# Altium schematic sheet ngv-main.SchDoc
size A2; PageSetup: Record=PageOptions|CenterHorizontal=True|CenterVertical=True|PrintScale=0.52|XCorrection=1.00|YCorrection=1.00|PrintKind=1|BorderSize=5000000|LeftOffset=0|BottomOffset=0|Orientation=2|PaperLength=1000|PaperWidth=1000|Scale=100|PaperSource=7|PrintQuality=600|MediaType=1|DitherType=10|PrintScaleMode=1|PaperKind=A4|PaperIndex=9
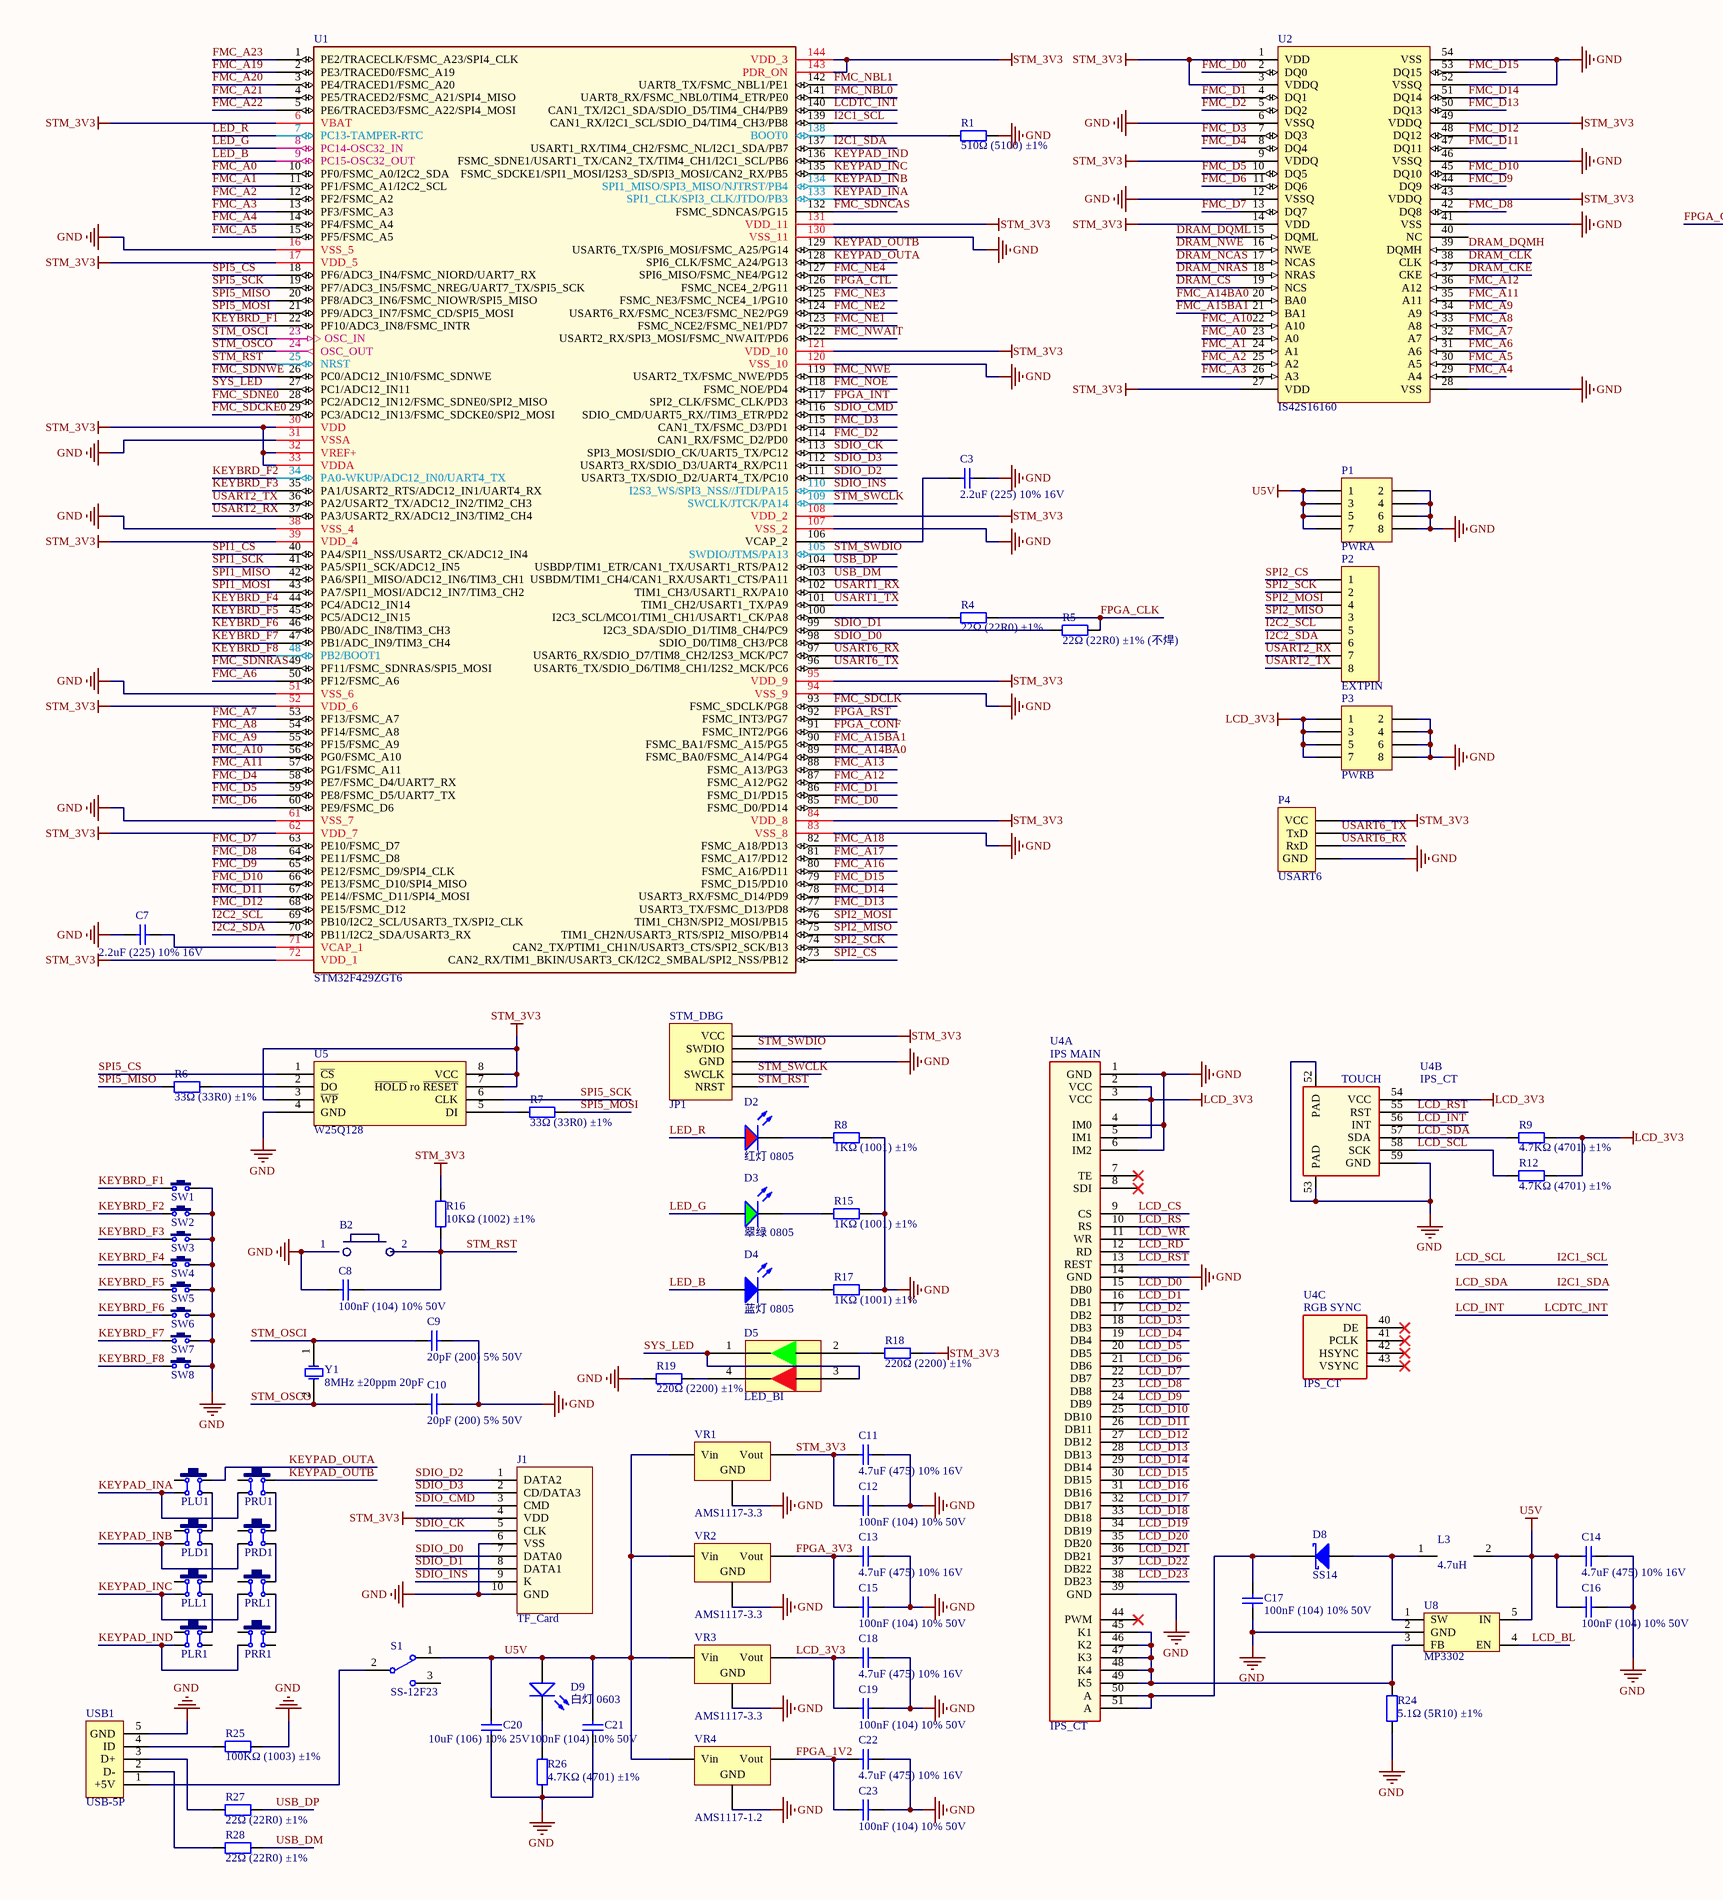
[diagram p0: ngv-main.SchDoc, left]
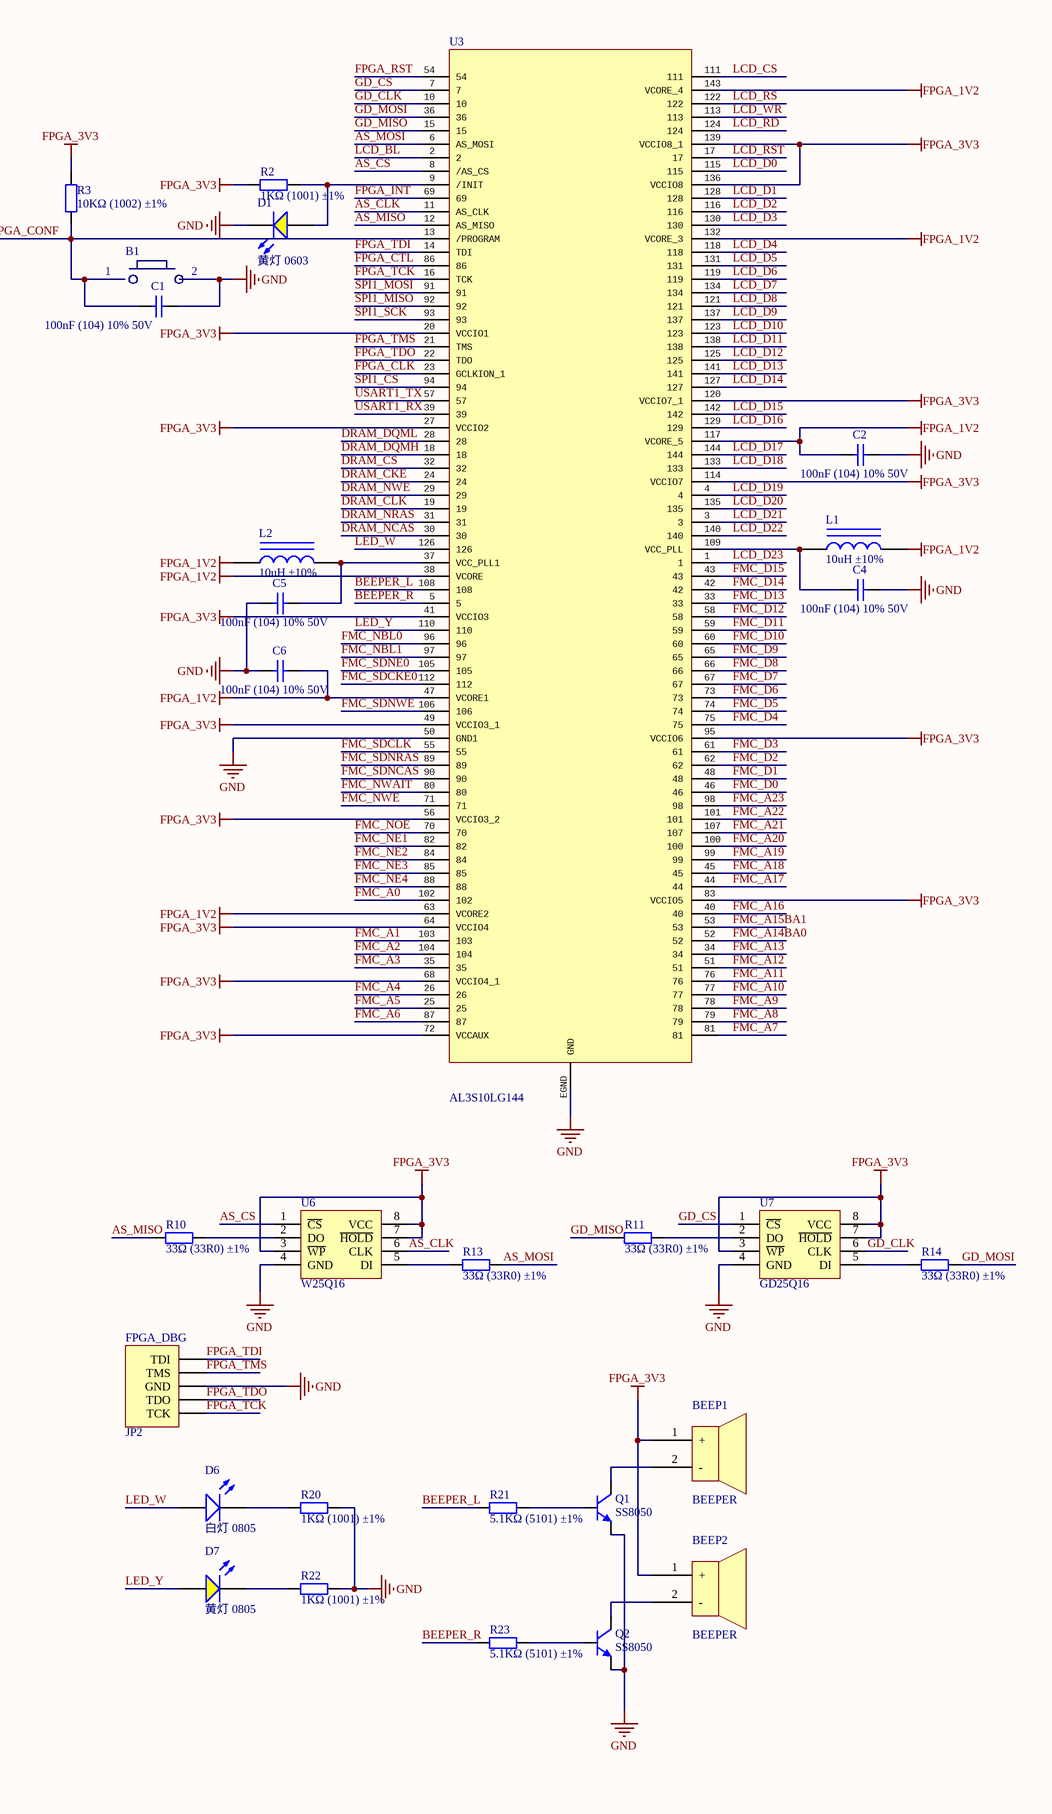
[diagram p1: ngv-main.SchDoc, right]

## Parts
B1  B1  [MetalButton]  (value not drawn)
B2  B1  [MetalButton]  (value not drawn)
BEEP1  BEEPER  [BEEPER]
BEEP2  BEEPER  [BEEPER]
C1  100nF (104) 10% 50V  [0603_C]
C2  100nF (104) 10% 50V  [0603_C]
C3  2.2uF (225) 10% 16V  [0603_C]
C4  100nF (104) 10% 50V  [0603_C]
C5  100nF (104) 10% 50V  [0603_C]
C6  100nF (104) 10% 50V  [0603_C]
C7  2.2uF (225) 10% 16V  [0603_C]
C8  100nF (104) 10% 50V  [0603_C]
C9  20pF (200) 5% 50V  [0603_C]
C10  20pF (200) 5% 50V  [0603_C]
C11  4.7uF (475) 10% 16V  [0603_C]
C12  100nF (104) 10% 50V  [0603_C]
C13  4.7uF (475) 10% 16V  [0603_C]
C14  4.7uF (475) 10% 16V  [0603_C]
C15  100nF (104) 10% 50V  [0603_C]
C16  100nF (104) 10% 50V  [0603_C]
C17  100nF (104) 10% 50V  [0603_C]
C18  4.7uF (475) 10% 16V  [0603_C]
C19  100nF (104) 10% 50V  [0603_C]
C20  10uF (106) 10% 25V  [0805_C]
C21  100nF (104) 10% 50V  [0603_C]
C22  4.7uF (475) 10% 16V  [0603_C]
C23  100nF (104) 10% 50V  [0603_C]
D1  黄灯 0603  [0603_LED_S1]
D2  红灯 0805  [0805_LED_S1]
D3  翠绿 0805  [0805_LED_S1]
D4  蓝灯 0805  [0805_LED_S1]
D5  LED_BI  [LED_BI]
D6  白灯 0805  [0805_LED_S1]
D7  黄灯 0805  [0805_LED_S1]
D8  SS14  [SOD123]
D9  白灯 0603  [0603_LED_S1]
J1  TF_Card  [Micro SD]
JP1  STM_DBG  [XH2.54-WS-5P]
JP2  FPGA_DBG  [XH2.54-WS-5P]
L1  10uH ±10%  [0603_L]
L2  10uH ±10%  [0603_L]
L3  4.7uH  [L453226]
P1  PWRA  [HDR2X4]
P2  EXTPIN  [HDR1X8]
P3  PWRB  [HDR2X4]
P4  USART6  [HDR1X4H]
PLD1  12x12x5  [TSW SMD-12*12*6]  (value not drawn)
PLL1  12x12x5  [TSW SMD-12*12*6]  (value not drawn)
PLR1  12x12x5  [TSW SMD-12*12*6]  (value not drawn)
PLU1  12x12x5  [TSW SMD-12*12*6]  (value not drawn)
PRD1  12x12x5  [TSW SMD-12*12*6]  (value not drawn)
PRL1  12x12x5  [TSW SMD-12*12*6]  (value not drawn)
PRR1  12x12x5  [TSW SMD-12*12*6]  (value not drawn)
PRU1  12x12x5  [TSW SMD-12*12*6]  (value not drawn)
Q1  SS8050  [SOT23-3M]
Q2  SS8050  [SOT23-3M]
R1  510Ω (5100) ±1%  [0603_R]
R2  1KΩ (1001) ±1%  [0603_R]
R3  10KΩ (1002) ±1%  [0603_R]
R4  22Ω (22R0) ±1%  [0805_R]
R5  22Ω (22R0) ±1% (不焊)  [0805_R]
R6  33Ω (33R0) ±1%  [0603_R]
R7  33Ω (33R0) ±1%  [0603_R]
R8  1KΩ (1001) ±1%  [0603_R]
R9  4.7KΩ (4701) ±1%  [0603_R]
R10  33Ω (33R0) ±1%  [0603_R]
R11  33Ω (33R0) ±1%  [0603_R]
R12  4.7KΩ (4701) ±1%  [0603_R]
R13  33Ω (33R0) ±1%  [0603_R]
R14  33Ω (33R0) ±1%  [0603_R]
R15  1KΩ (1001) ±1%  [0603_R]
R16  10KΩ (1002) ±1%  [0603_R]
R17  1KΩ (1001) ±1%  [0603_R]
R18  220Ω (2200) ±1%  [0402_R]
R19  220Ω (2200) ±1%  [0402_R]
R20  1KΩ (1001) ±1%  [0603_R]
R21  5.1KΩ (5101) ±1%  [0603_R]
R22  1KΩ (1001) ±1%  [0603_R]
R23  5.1KΩ (5101) ±1%  [0603_R]
R24  5.1Ω (5R10) ±1%  [0603_R]
R25  100KΩ (1003) ±1%  [0603_R]
R26  4.7KΩ (4701) ±1%  [0603_R]
R27  22Ω (22R0) ±1%  [0603_R]
R28  22Ω (22R0) ±1%  [0603_R]
S1  SS-12F23  [SS-12F23]
SW1  3x6x5  [TSW SMD-3*6*4.3]  (value not drawn)
SW2  3x6x5  [TSW SMD-3*6*4.3]  (value not drawn)
SW3  3x6x5  [TSW SMD-3*6*4.3]  (value not drawn)
SW4  3x6x5  [TSW SMD-3*6*4.3]  (value not drawn)
SW5  3x6x5  [TSW SMD-3*6*4.3]  (value not drawn)
SW6  3x6x5  [TSW SMD-3*6*4.3]  (value not drawn)
SW7  3x6x5  [TSW SMD-3*6*4.3]  (value not drawn)
SW8  3x6x5  [TSW SMD-3*6*4.3]  (value not drawn)
U1  STM32F429ZGT6  [LQFP-144_20x20x05P]
U2  IS42S16160  [TSOP54-II]
U3  AL3S10LG144  [AL_EQFP144]
U4  IPS_CT  [IPS_CT]  (parts A,B,C of 3)
U5  W25Q128  [SOIC-8_208mil]
U6  W25Q16  [SOP8W_N]
U7  GD25Q16  [SOP8W_N]
U8  MP3302  [SOT23-5]
USB1  USB-5P  [USB-MICRO_D]
VR1  AMS1117-3.3  [SOT-223]
VR2  AMS1117-3.3  [SOT-223]
VR3  AMS1117-3.3  [SOT-223]
VR4  AMS1117-1.2  [SOT-223]
Y1  8MHz ±20ppm 20pF  [SMD-5032_2P]

## Nets
FPGA_1V2: C2.1 C6.2 C22.2 C23.2 L1.2 L2.1 U3.38(VCORE) U3.47(VCORE1) U3.63(VCORE2) U3.117(VCORE_5) U3.132(VCORE_3) U3.143(VCORE_4) VR4.2(Vout)
FPGA_3V3: BEEP1.1(+) BEEP2.1(+) C13.2 C15.2 R2.1 R3.2 U3.20(VCCIO1) U3.27(VCCIO2) U3.41(VCCIO3) U3.49(VCCIO3_1) U3.56(VCCIO3_2) U3.64(VCCIO4) U3.68(VCCIO4_1) U3.72(VCCAUX) U3.83(VCCIO5) U3.95(VCCIO6) U3.114(VCCIO7) U3.120(VCCIO7_1) U3.136(VCCIO8) U3.139(VCCIO8_1) U6.3(~{WP}) U6.7(~{HOLD}) U6.8(VCC) U7.3(~{WP}) U7.7(~{HOLD}) U7.8(VCC) VR2.2(Vout)
GND: B1.2 B2.1 C1.2 C2.2 C3.2 C4.2 C5.1 C6.1 C7.1 C8.1 C9.2 C10.2 C11.1 C12.1 C13.1 C14.2 C15.1 C16.2 C17.1 C18.1 C19.1 C20.1 C21.1 C22.1 C23.1 D1.K J1.6(VSS) J1.10(GND) JP1.3(GND) JP2.3(GND) P1.2 P1.4 P1.6 P1.8 P3.2 P3.4 P3.6 P3.8 P4.1(GND) Q1.2(E) Q2.2(E) R1.2 R8.2 R15.2 R17.2 R19.1 R20.2 R22.2 R24.1 R25.2 R26.1 SW1.2 SW2.2 SW3.2 SW4.2 SW5.2 SW6.2 SW7.2 SW8.2 U1.16(VSS_5) U1.31(VSSA) U1.38(VSS_4) U1.51(VSS_6) U1.61(VSS_7) U1.83(VSS_8) U1.94(VSS_9) U1.107(VSS_2) U1.120(VSS_10) U1.130(VSS_11) U2.6(VSSQ) U2.12(VSSQ) U2.28(VSS) U2.41(VSS) U2.46(VSSQ) U2.52(VSSQ) U2.54(VSS) U3.50(GND1) U3.EGND(GND) U4.1(GND) U4.4(IM0) U4.6(IM2) U4.14(GND) U4.39(GND) U4.52(PAD) U4.53(PAD) U4.59(GND) U5.4(GND) U6.4(GND) U7.4(GND) U8.2(GND) USB1.5(GND) VR1.1(GND) VR2.1(GND) VR3.1(GND) VR4.1(GND)
LCD_3V3: C18.2 C19.2 P3.1 P3.3 P3.5 P3.7 R9.2 R12.2 U4.2(VCC) U4.3(VCC) U4.5(IM1) U4.54(VCC) VR3.2(Vout)
STM_3V3: C11.2 C12.2 J1.4(VDD) JP1.5(VCC) P4.4(VCC) R16.2 R18.2 U1.6(VBAT) U1.17(VDD_5) U1.30(VDD) U1.32(VREF+) U1.33(VDDA) U1.39(VDD_4) U1.52(VDD_6) U1.62(VDD_7) U1.72(VDD_1) U1.84(VDD_8) U1.95(VDD_9) U1.108(VDD_2) U1.121(VDD_10) U1.131(VDD_11) U1.143(PDR_ON) U1.144(VDD_3) U2.1(VDD) U2.3(VDDQ) U2.9(VDDQ) U2.14(VDD) U2.27(VDD) U2.43(VDDQ) U2.49(VDDQ) U5.3(~{WP}) U5.7(~{HOLD}_ro_~{RESET}) U5.8(VCC) VR1.2(Vout)
U5V: C14.1 C16.1 C20.2 C21.2 D9.A L3.2 P1.1 P1.3 P1.5 P1.7 S1.1 U8.5(IN) VR1.3(Vin) VR2.3(Vin) VR3.3(Vin) VR4.3(Vin)
AS_CLK: U3.11(AS_CLK) U6.6(CLK)
AS_CS: U3.8(/AS_CS) U6.1(~{CS})
AS_MISO: R10.1 U3.12(AS_MISO)
AS_MOSI: R13.2 U3.6(AS_MOSI)
BEEPER_L: R21.1 U3.108
BEEPER_R: R23.1 U3.5
DRAM_CKE: U2.37(CKE) U3.24
DRAM_CLK: U2.38(CLK) U3.19
DRAM_CS: U2.19(NCS) U3.32
DRAM_DQMH: U2.39(DQMH) U3.18
DRAM_DQML: U2.15(DQML) U3.28
DRAM_NCAS: U2.17(NCAS) U3.30
DRAM_NRAS: U2.18(NRAS) U3.31
DRAM_NWE: U2.16(NWE) U3.29
FMC_A0: U1.10(PF0/FSMC_A0/I2C2_SDA) U2.23(A0) U3.102
FMC_A1: U1.11(PF1/FSMC_A1/I2C2_SCL) U2.24(A1) U3.103
FMC_A2: U1.12(PF2/FSMC_A2) U2.25(A2) U3.104
FMC_A3: U1.13(PF3/FSMC_A3) U2.26(A3) U3.35
FMC_A4: U1.14(PF4/FSMC_A4) U2.29(A4) U3.26
FMC_A5: U1.15(PF5/FSMC_A5) U2.30(A5) U3.25
FMC_A6: U1.50(PF12/FSMC_A6) U2.31(A6) U3.87
FMC_A7: U1.53(PF13/FSMC_A7) U2.32(A7) U3.81
FMC_A8: U1.54(PF14/FSMC_A8) U2.33(A8) U3.79
FMC_A9: U1.55(PF15/FSMC_A9) U2.34(A9) U3.78
FMC_A10: U1.56(PG0/FSMC_A10) U2.22(A10) U3.77
FMC_A11: U1.57(PG1/FSMC_A11) U2.35(A11) U3.76
FMC_A12: U1.87(FSMC_A12/PG2) U2.36(A12) U3.51
FMC_A13: U1.88(FSMC_A13/PG3) U3.34
FMC_A14BA0: U1.89(FSMC_BA0/FSMC_A14/PG4) U2.20(BA0) U3.52
FMC_A15BA1: U1.90(FSMC_BA1/FSMC_A15/PG5) U2.21(BA1) U3.53
FMC_A16: U1.80(FSMC_A16/PD11) U3.40
FMC_A17: U1.81(FSMC_A17/PD12) U3.44
FMC_A18: U1.82(FSMC_A18/PD13) U3.45
FMC_A19: U1.2(PE3/TRACED0/FSMC_A19) U3.99
FMC_A20: U1.3(PE4/TRACED1/FSMC_A20) U3.100
FMC_A21: U1.4(PE5/TRACED2/FSMC_A21/SPI4_MISO) U3.107
FMC_A22: U1.5(PE6/TRACED3/FSMC_A22/SPI4_MOSI) U3.101
FMC_A23: U1.1(PE2/TRACECLK/FSMC_A23/SPI4_CLK) U3.98
FMC_D0: U1.85(FSMC_D0/PD14) U2.2(DQ0) U3.46
FMC_D1: U1.86(FSMC_D1/PD15) U2.4(DQ1) U3.48
FMC_D2: U1.114(CAN1_RX/FSMC_D2/PD0) U2.5(DQ2) U3.62
FMC_D3: U1.115(CAN1_TX/FSMC_D3/PD1) U2.7(DQ3) U3.61
FMC_D4: U1.58(PE7/FSMC_D4/UART7_RX) U2.8(DQ4) U3.75
FMC_D5: U1.59(PE8/FSMC_D5/UART7_TX) U2.10(DQ5) U3.74
FMC_D6: U1.60(PE9/FSMC_D6) U2.11(DQ6) U3.73
FMC_D7: U1.63(PE10/FSMC_D7) U2.13(DQ7) U3.67
FMC_D8: U1.64(PE11/FSMC_D8) U2.42(DQ8) U3.66
FMC_D9: U1.65(PE12/FSMC_D9/SPI4_CLK) U2.44(DQ9) U3.65
FMC_D10: U1.66(PE13/FSMC_D10/SPI4_MISO) U2.45(DQ10) U3.60
FMC_D11: U1.67(PE14//FSMC_D11/SPI4_MOSI) U2.47(DQ11) U3.59
FMC_D12: U1.68(PE15/FSMC_D12) U2.48(DQ12) U3.58
FMC_D13: U1.77(USART3_TX/FSMC_D13/PD8) U2.50(DQ13) U3.33
FMC_D14: U1.78(USART3_RX/FSMC_D14/PD9) U2.51(DQ14) U3.42
FMC_D15: U1.79(FSMC_D15/PD10) U2.53(DQ15) U3.43
FMC_NBL0: U1.141(UART8_RX/FSMC_NBL0/TIM4_ETR/PE0) U3.96
FMC_NBL1: U1.142(UART8_TX/FSMC_NBL1/PE1) U3.97
FMC_NE1: U1.123(FSMC_NCE2/FSMC_NE1/PD7) U3.82
FMC_NE2: U1.124(USART6_RX/FSMC_NCE3/FSMC_NE2/PG9) U3.84
FMC_NE3: U1.125(FSMC_NE3/FSMC_NCE4_1/PG10) U3.85
FMC_NE4: U1.127(SPI6_MISO/FSMC_NE4/PG12) U3.88
FMC_NOE: U1.118(FSMC_NOE/PD4) U3.70
FMC_NWAIT: U1.122(USART2_RX/SPI3_MOSI/FSMC_NWAIT/PD6) U3.80
FMC_NWE: U1.119(USART2_TX/FSMC_NWE/PD5) U3.71
FMC_SDCKE0: U1.29(PC3/ADC12_IN13/FSMC_SDCKE0/SPI2_MOSI) U3.112
FMC_SDCLK: U1.93(FSMC_SDCLK/PG8) U3.55
FMC_SDNCAS: U1.132(FSMC_SDNCAS/PG15) U3.90
FMC_SDNE0: U1.28(PC2/ADC12_IN12/FSMC_SDNE0/SPI2_MISO) U3.105
FMC_SDNRAS: U1.49(PF11/FSMC_SDNRAS/SPI5_MOSI) U3.89
FMC_SDNWE: U1.26(PC0/ADC12_IN10/FSMC_SDNWE) U3.106
FPGA_CLK: R4.2 R5.2 U3.23(GCLKION_1)
FPGA_CONF: B1.1 C1.1 R3.1 U1.91(FSMC_INT2/PG6) U3.13(/PROGRAM)
FPGA_CTL: U1.126(FSMC_NCE4_2/PG11) U3.86
FPGA_INT: U1.117(SPI2_CLK/FSMC_CLK/PD3) U3.69
FPGA_RST: U1.92(FSMC_INT3/PG7) U3.54
FPGA_TCK: JP2.1(TCK) U3.16(TCK)
FPGA_TDI: JP2.5(TDI) U3.14(TDI)
FPGA_TDO: JP2.2(TDO) U3.22(TDO)
FPGA_TMS: JP2.4(TMS) U3.21(TMS)
GD_CLK: U3.10 U7.6(CLK)
GD_CS: U3.7 U7.1(~{CS})
GD_MISO: R11.1 U3.15
GD_MOSI: R14.2 U3.36
I2C1_SCL: R12.1 U1.139(CAN1_RX/I2C1_SCL/SDIO_D4/TIM4_CH3/PB8) U4.58(SCK)  [also labelled LCD_SCL]
I2C1_SDA: R9.1 U1.137(USART1_RX/TIM4_CH2/FSMC_NL/I2C1_SDA/PB7) U4.57(SDA)  [also labelled LCD_SDA]
I2C2_SCL: P2.5 U1.69(PB10/I2C2_SCL/USART3_TX/SPI2_CLK)
I2C2_SDA: P2.6 U1.70(PB11/I2C2_SDA/USART3_RX)
KEYBRD_F1: SW1.1 U1.22(PF10/ADC3_IN8/FSMC_INTR)
KEYBRD_F2: SW2.1 U1.34(PA0-WKUP/ADC12_IN0/UART4_TX)
KEYBRD_F3: SW3.1 U1.35(PA1/USART2_RTS/ADC12_IN1/UART4_RX)
KEYBRD_F4: SW4.1 U1.44(PC4/ADC12_IN14)
KEYBRD_F5: SW5.1 U1.45(PC5/ADC12_IN15)
KEYBRD_F6: SW6.1 U1.46(PB0/ADC_IN8/TIM3_CH3)
KEYBRD_F7: SW7.1 U1.47(PB1/ADC_IN9/TIM3_CH4)
KEYBRD_F8: SW8.1 U1.48(PB2/BOOT1)
KEYPAD_INA: PLU1.4 PRU1.4 U1.133(SPI1_CLK/SPI3_CLK/JTDO/PB3)
KEYPAD_INB: PLD1.4 PRD1.4 U1.134(SPI1_MISO/SPI3_MISO/NJTRST/PB4)
KEYPAD_INC: PLL1.4 PRL1.4 U1.135(FSMC_SDCKE1/SPI1_MOSI/I2S3_SD/SPI3_MOSI/CAN2_RX/PB5)
KEYPAD_IND: PLR1.4 PRR1.4 U1.136(FSMC_SDNE1/USART1_TX/CAN2_TX/TIM4_CH1/I2C1_SCL/PB6)
KEYPAD_OUTA: PLU1.2 U1.128(SPI6_CLK/FSMC_A24/PG13)
KEYPAD_OUTB: PRU1.2 U1.129(USART6_TX/SPI6_MOSI/FSMC_A25/PG14)
LCD_BL: U3.2 U8.4(EN)
LCD_CS: U3.111 U4.9(CS)
LCD_D0: U3.115 U4.15(DB0)
LCD_D1: U3.128 U4.16(DB1)
LCD_D2: U3.116 U4.17(DB2)
LCD_D3: U3.130 U4.18(DB3)
LCD_D4: U3.118 U4.19(DB4)
LCD_D5: U3.131 U4.20(DB5)
LCD_D6: U3.119 U4.21(DB6)
LCD_D7: U3.134 U4.22(DB7)
LCD_D8: U3.121 U4.23(DB8)
LCD_D9: U3.137 U4.24(DB9)
LCD_D10: U3.123 U4.25(DB10)
LCD_D11: U3.138 U4.26(DB11)
LCD_D12: U3.125 U4.27(DB12)
LCD_D13: U3.141 U4.28(DB13)
LCD_D14: U3.127 U4.29(DB14)
LCD_D15: U3.142 U4.30(DB15)
LCD_D16: U3.129 U4.31(DB16)
LCD_D17: U3.144 U4.32(DB17)
LCD_D18: U3.133 U4.33(DB18)
LCD_D19: U3.4 U4.34(DB19)
LCD_D20: U3.135 U4.35(DB20)
LCD_D21: U3.3 U4.36(DB21)
LCD_D22: U3.140 U4.37(DB22)
LCD_D23: U3.1 U4.38(DB23)
LCD_INT: U1.140(CAN1_TX/I2C1_SDA/SDIO_D5/TIM4_CH4/PB9) U4.56(INT)  [also labelled LCDTC_INT]
LCD_RD: U3.124 U4.12(RD)
LCD_RS: U3.122 U4.10(RS)
LCD_RST: U3.17 U4.13(REST) U4.55(RST)
LCD_WR: U3.113 U4.11(WR)
LED_B: D4.A U1.9(PC15-OSC32_OUT)
LED_G: D3.A U1.8(PC14-OSC32_IN)
LED_R: D2.A U1.7(PC13-TAMPER-RTC)
LED_W: D6.A U3.126
LED_Y: D7.A U3.110
SDIO_CK: J1.5(CLK) U1.113(SPI3_MOSI/SDIO_CK/UART5_TX/PC12)
SDIO_CMD: J1.3(CMD) U1.116(SDIO_CMD/UART5_RX//TIM3_ETR/PD2)
SDIO_D0: J1.7(DATA0) U1.98(SDIO_D0/TIM8_CH3/PC8)
SDIO_D1: J1.8(DATA1) R5.1 U1.99(I2C3_SDA/SDIO_D1/TIM8_CH4/PC9)
SDIO_D2: J1.1(DATA2) U1.111(USART3_TX/SDIO_D2/UART4_TX/PC10)
SDIO_D3: J1.2(CD/DATA3) U1.112(USART3_RX/SDIO_D3/UART4_RX/PC11)
SDIO_INS: J1.9(K) U1.110(I2S3_WS/SPI3_NSS//JTDI/PA15)
SPI1_CS: U1.40(PA4/SPI1_NSS/USART2_CK/ADC12_IN4) U3.94
SPI1_MISO: U1.42(PA6/SPI1_MISO/ADC12_IN6/TIM3_CH1) U3.92
SPI1_MOSI: U1.43(PA7/SPI1_MOSI/ADC12_IN7/TIM3_CH2) U3.91
SPI1_SCK: U1.41(PA5/SPI1_SCK/ADC12_IN5) U3.93
SPI2_CS: P2.1 U1.73(CAN2_RX/TIM1_BKIN/USART3_CK/I2C2_SMBAL/SPI2_NSS/PB12)
SPI2_MISO: P2.3 U1.75(TIM1_CH2N/USART3_RTS/SPI2_MISO/PB14)
SPI2_MOSI: P2.4 U1.76(TIM1_CH3N/SPI2_MOSI/PB15)
SPI2_SCK: P2.2 U1.74(CAN2_TX/PTIM1_CH1N/USART3_CTS/SPI2_SCK/B13)
SPI5_CS: U1.18(PF6/ADC3_IN4/FSMC_NIORD/UART7_RX) U5.1(~{CS})
SPI5_MISO: R6.1 U1.20(PF8/ADC3_IN6/FSMC_NIOWR/SPI5_MISO)
SPI5_MOSI: R7.2 U1.21(PF9/ADC3_IN7/FSMC_CD/SPI5_MOSI)
SPI5_SCK: U1.19(PF7/ADC3_IN5/FSMC_NREG/UART7_TX/SPI5_SCK) U5.6(CLK)
STM_OSCI: C9.1 U1.23(OSC_IN) Y1.1(OSC1)
STM_OSCO: C10.1 U1.24(OSC_OUT) Y1.2(OSC2)
STM_RST: B2.2 C8.2 JP1.1(NRST) R16.1 U1.25(NRST)
STM_SWCLK: JP1.2(SWCLK) U1.109(SWCLK/JTCK/PA14)
STM_SWDIO: JP1.4(SWDIO) U1.105(SWDIO/JTMS/PA13)
SYS_LED: D5.1 D5.3 U1.27(PC1/ADC12_IN11)
USART1_RX: U1.102(TIM1_CH3/USART1_RX/PA10) U3.39
USART1_TX: U1.101(TIM1_CH2/USART1_TX/PA9) U3.57
USART2_RX: P2.7 U1.37(PA3/USART2_RX/ADC12_IN3/TIM2_CH4)
USART2_TX: P2.8 U1.36(PA2/USART2_TX/ADC12_IN2/TIM2_CH3)
USART6_RX: P4.2(RxD) U1.97(USART6_RX/SDIO_D7/TIM8_CH2/I2S3_MCK/PC7)
USART6_TX: P4.3(TxD) U1.96(USART6_TX/SDIO_D6/TIM8_CH1/I2S2_MCK/PC6)
USB_DM: R28.2 U1.103(USBDM/TIM1_CH4/CAN1_RX/USART1_CTS/PA11)
USB_DP: R27.2 U1.104(USBDP/TIM1_ETR/CAN1_TX/USART1_RTS/PA12)
NetBEEP1_2: BEEP1.2(-) Q1.3(C)
NetBEEP2_2: BEEP2.2(-) Q2.3(C)
NetC3_1: C3.1 U1.106(VCAP_2)
NetC4_1: C4.1 L1.1 U3.109(VCC_PLL)
NetC5_2: C5.2 L2.2 U3.37(VCC_PLL1)
NetC7_2: C7.2 U1.71(VCAP_1)
NetC17_2: C17.2 D8.2(K) U4.50(A) U4.51(A)
NetD1_A: D1.A R2.2 U3.9(/INIT)
NetD2_K: D2.K R8.1
NetD3_K: D3.K R15.1
NetD4_K: D4.K R17.1
NetD5_2: D5.2 R18.1
NetD5_4: D5.4 R19.2
NetD6_K: D6.K R20.1
NetD7_K: D7.K R22.1
NetD8_1: D8.1(A) L3.1 U8.1(SW)
NetD9_K: D9.K R26.2
NetPLD1_2: PLD1.2 PLU1.3
NetPLD1_3: PLD1.3 PLL1.2
NetPLL1_3: PLL1.3 PLR1.2
NetPRD1_2: PRD1.2 PRU1.3
NetPRD1_3: PRD1.3 PRL1.2
NetPRL1_3: PRL1.3 PRR1.2
NetQ1_1: Q1.1(B) R21.2
NetQ2_1: Q2.1(B) R23.2
NetR1_1: R1.1 U1.138(BOOT0)
NetR4_1: R4.1 U1.100(I2C3_SCL/MCO1/TIM1_CH1/USART1_CK/PA8)
NetR6_2: R6.2 U5.2(DO)
NetR7_1: R7.1 U5.5(DI)
NetR10_2: R10.2 U6.2(DO)
NetR11_2: R11.2 U7.2(DO)
NetR13_1: R13.1 U6.5(DI)
NetR14_1: R14.1 U7.5(DI)
NetR24_2: R24.2 U4.45(K1) U4.46(K2) U4.47(K3) U4.48(K4) U4.49(K5) U8.3(FB)
NetR25_1: R25.1 USB1.4(ID)
NetR27_1: R27.1 USB1.3(D+)
NetR28_1: R28.1 USB1.2(D-)
NetS1_2: S1.2 USB1.1(+5V)

Not connected (* = marked no-connect by the designer): PLD1 1; PLL1 1; PLR1 1 3; PLU1 1; PRD1 1; PRL1 1; PRR1 1 3; PRU1 1; S1 3; U2 40(NC); U4 7(TE)* 8(SDI)* 40(DE)* 41(PCLK)* 42(HSYNC)* 43(VSYNC)* 44(PWM)*

## Notes on the sheet
- (in symbol IPS_CT, part A) IPS MAIN
- (in symbol IPS_CT, part B) TOUCH
- (in symbol IPS_CT, part C) RGB SYNC

## Library data of the parts
B1 B2 = MetalButton
C1 C2 C4-C6 C8 C12 C15-C17 C19 C21 C23 = 0603 100nF (104) 10% 50V: 贴片电容; ComponentLink1Description: 供应商链接; ComponentLink1URL: http://www.szlcsc.com/product/details_15331.html; Package: 0603; Supplier: LC; SuppliersPartNumber: C14663
C3 C7 = 0603 2.2uF (225) 10% 16V: 贴片电容; ComponentLink1Description: 供应商链接; ComponentLink1URL: http://www.szlcsc.com/product/details_24366.html; Package: 0603; Supplier: LC; SuppliersPartNumber: C23630
C9 C10 = 0603 20pF (200) 5% 50V: 贴片电容; ComponentLink1Description: 供应商链接; ComponentLink1URL: http://www.szlcsc.com/product/details_2000.html; Package: 0603; Supplier: LC; SuppliersPartNumber: C1648
C11 C13 C14 C18 C22 = 0603 4.7uF (475) 10% 16V: 贴片电容; ComponentLink1Description: 供应商链接; ComponentLink1URL: http://www.szlcsc.com/product/details_20375.html; Package: 0603; Supplier: LC; SuppliersPartNumber: C19666
C20 = 0805 10uF (106) 10% 25V: 贴片电容; ComponentLink1Description: 供应商链接; ComponentLink1URL: http://www.szlcsc.com/product/details_16532.html; Package: 0805; Supplier: LC; SuppliersPartNumber: C15850
D1 = 0603 黄灯: 发光二极管; ComponentLink1Description: 供应商链接; ComponentLink1URL: http://www.szlcsc.com/product/details_73147.html; Package: 0603; Supplier: LC; SuppliersPartNumber: C72038
D2 = 0805 红灯: 发光二极管; ComponentLink1Description: 供应商链接; ComponentLink1URL: http://www.szlcsc.com/product/details_2668.html; Package: 0805; Supplier: LC; SuppliersPartNumber: C2295
D3 = 0805 翠绿: 发光二极管; ComponentLink1Description: 供应商链接; ComponentLink1URL: http://www.szlcsc.com/product/details_2670.html; Package: 0805; Supplier: LC; SuppliersPartNumber: C2297
D4 = 0805 蓝灯: 发光二极管; ComponentLink1Description: 供应商链接; ComponentLink1URL: http://www.szlcsc.com/product/details_2666.html; Package: 0805; Supplier: LC; SuppliersPartNumber: C2293
D6 = 0805 白灯: 发光二极管; ComponentLink1Description: 供应商链接; ComponentLink1URL: http://www.szlcsc.com/product/details_35468.html; Package: 0805; Supplier: LC; SuppliersPartNumber: C34499
D7 = 0805 黄灯: 发光二极管; ComponentLink1Description: 供应商链接; ComponentLink1URL: http://www.szlcsc.com/product/details_2669.html; Package: 0805; Supplier: LC; SuppliersPartNumber: C2296
D9 = 0603 白灯: 发光二极管; ComponentLink1Description: 供应商链接; ComponentLink1URL: http://www.szlcsc.com/product/details_2663.html; Package: 0603; Supplier: LC; SuppliersPartNumber: C2290
J1 = TF_Card: TF卡座; 版权归属: 源创客; BOM名称: TF卡座; 学习资源: www.ooocke.com
JP1 = STM_HDR: STM32; BOM名称: 5P接插件; 版权归属: 源创客; 学习资源: www.ooocke.com
JP2 = FPGA_HDR: FPGA; BOM名称: 5P接插件; 版权归属: 源创客; 学习资源: www.ooocke.com
L1 L2 = 0603 10uH 10%: 贴片电感; ComponentLink1Description: 供应商链接; ComponentLink1URL: http://www.szlcsc.com/product/details_1387.html; Package: 0603; Supplier: LC; SuppliersPartNumber: C1035
P1 P3 = Header 4X2: Header, 4-Pin, Dual row; LatestRevisionDate: 17-Jul-2002; LatestRevisionNote: Re-released for DXP Platform.; Publisher: Altium Limited
P2 = Header 8: Header, 8-Pin; LatestRevisionDate: 17-Jul-2002; LatestRevisionNote: Re-released for DXP Platform.; Publisher: Altium Limited
P4 = Header 4H: Header, 4-Pin, Right Angle; LatestRevisionDate: 17-Jul-2002; LatestRevisionNote: Re-released for DXP Platform.; Publisher: Altium Limited
PLD1 PLL1 PLR1 PLU1 PRD1 PRL1 PRR1 PRU1 = TSW SMD-12x12: 贴片12x12轻触开关; 版权归属: 源创客; BOM名称: 贴片12x12轻触开关; 学习资源: www.ooocke.com
Q1 Q2 = 8050-SMD: 高频放大-NPN型; 版权归属: 源创客; 属性: 40V 1.5A 1W 100MHZ; BOM名称: 高频放大-NPN型; 学习资源: www.ooocke.com
R1 = 0603 510Ω (5100) 1%: 贴片电阻; ComponentLink1Description: 供应商链接; ComponentLink1URL: http://www.szlcsc.com/product/details_23920.html; Package: 0603; Supplier: LC; SuppliersPartNumber: C23193
R2 R8 R15 R17 R20 R22 = 0603 1KΩ (1001) 1%: 贴片电阻; ComponentLink1Description: 供应商链接; ComponentLink1URL: http://www.szlcsc.com/product/details_21904.html; Package: 0603; Supplier: LC; SuppliersPartNumber: C21190
R3 R16 = 0603 10KΩ (1002) 1%: 贴片电阻; ComponentLink1Description: 供应商链接; ComponentLink1URL: http://www.szlcsc.com/product/details_26547.html; Package: 0603; Supplier: LC; SuppliersPartNumber: C25804
R4 R5 = 0805 22Ω (22R0) 1%: 贴片电阻; ComponentLink1Description: 供应商链接; ComponentLink1URL: http://www.szlcsc.com/product/details_18249.html; Package: 0805; Supplier: LC; SuppliersPartNumber: C17561
R6 R7 R10 R11 R13 R14 = 0603 33Ω (33R0) 1%: 贴片电阻; ComponentLink1Description: 供应商链接; ComponentLink1URL: http://www.szlcsc.com/product/details_23867.html; Package: 0603; Supplier: LC; SuppliersPartNumber: C23140
R9 R12 R26 = 0603 4.7KΩ (4701) 1%: 贴片电阻; ComponentLink1Description: 供应商链接; ComponentLink1URL: http://www.szlcsc.com/product/details_23889.html; Package: 0603; Supplier: LC; SuppliersPartNumber: C23162
R18 R19 = 0402 220Ω (2200) 1%: 贴片电阻; ComponentLink1Description: 供应商链接; ComponentLink1URL: http://www.szlcsc.com/product/details_25834.html; Package: 0402; Supplier: LC; SuppliersPartNumber: C25091
R21 R23 = 0603 5.1KΩ (5101) 1%: 贴片电阻; ComponentLink1Description: 供应商链接; ComponentLink1URL: http://www.szlcsc.com/product/details_23913.html; Package: 0603; Supplier: LC; SuppliersPartNumber: C23186
R24 = 0603 5.1Ω (5R10) 1%: 贴片电阻; ComponentLink1Description: 供应商链接; ComponentLink1URL: http://www.szlcsc.com/product/details_25940.html; Package: 0603; Supplier: LC; SuppliersPartNumber: C25197
R25 = 0603 100KΩ (1003) 1%: 贴片电阻; ComponentLink1Description: 供应商链接; ComponentLink1URL: http://www.szlcsc.com/product/details_26546.html; Package: 0603; Supplier: LC; SuppliersPartNumber: C25803
R27 R28 = 0603 22Ω (22R0) 1%: 贴片电阻; ComponentLink1Description: 供应商链接; ComponentLink1URL: http://www.szlcsc.com/product/details_24078.html; Package: 0603; Supplier: LC; SuppliersPartNumber: C23345
S1 = SSW-1P: 1路波动开关; BOM名称: 波动开关; 版权归属: 源创客; 学习资源: www.ooocke.com
SW1-SW8 = TSW 3x6: 3x6轻触开关; 版权归属: 源创客; BOM名称: 3x6轻触开关; 学习资源: www.ooocke.com
U1 = STM32F429ZGT6: ARM; ComponentLink1Description: 供应商链接; ComponentLink1URL: http://www.szlcsc.com/product/details_47529.html; Package: LQFP-144_20x20x05P; Supplier: LC; SuppliersPartNumber: C46525
U5 = W25Q128FVSIG_[C35101]: Flash ROM; ComponentLink1Description: 供应商链接; ComponentLink1URL: http://www.szlcsc.com/product/details_36072.html; Package: SOIC-8; Supplier: LC; SuppliersPartNumber: C35101
U6 U7 = W25Qxx: 外置Flash; 版权归属: 源创客; BOM名称: 外置Flash; 学习资源: www.ooocke.com
USB1 = USB-5P: 微型USB母座; 版权归属: 源创客; BOM名称: 微型USB母座; 学习资源: www.ooocke.com
VR1-VR4 = SOT-223 AMS1117-3.3: 低压差线性稳压(LDO); ComponentLink1Description: 供应商链接; ComponentLink1URL: http://www.szlcsc.com/product/details_6652.html; Package: SOT-223; Supplier: LC; SuppliersPartNumber: C6186
Y1 = SMD-5032_2P 8MHz 20ppm 20pF: 贴片晶振; ComponentLink1Description: 供应商链接; ComponentLink1URL: http://www.szlcsc.com/product/details_117214.html; Package: SMD-5032_2P; Supplier: LC; SuppliersPartNumber: C115962
D8 = SS14: Published: 8-Jun-2000; LatestRevisionDate: 17-Jul-2002; LatestRevisionNote: Re-released for DXP Platform.; PackageReference: SMB; Publisher: Altium Limited; PackageDescription: DO-214-AA/SMB; 2 C-Bend Leads; Body 5.3 x 3.6 mm, inc. leads (LxW); Code_JEDEC: DO-214-AA